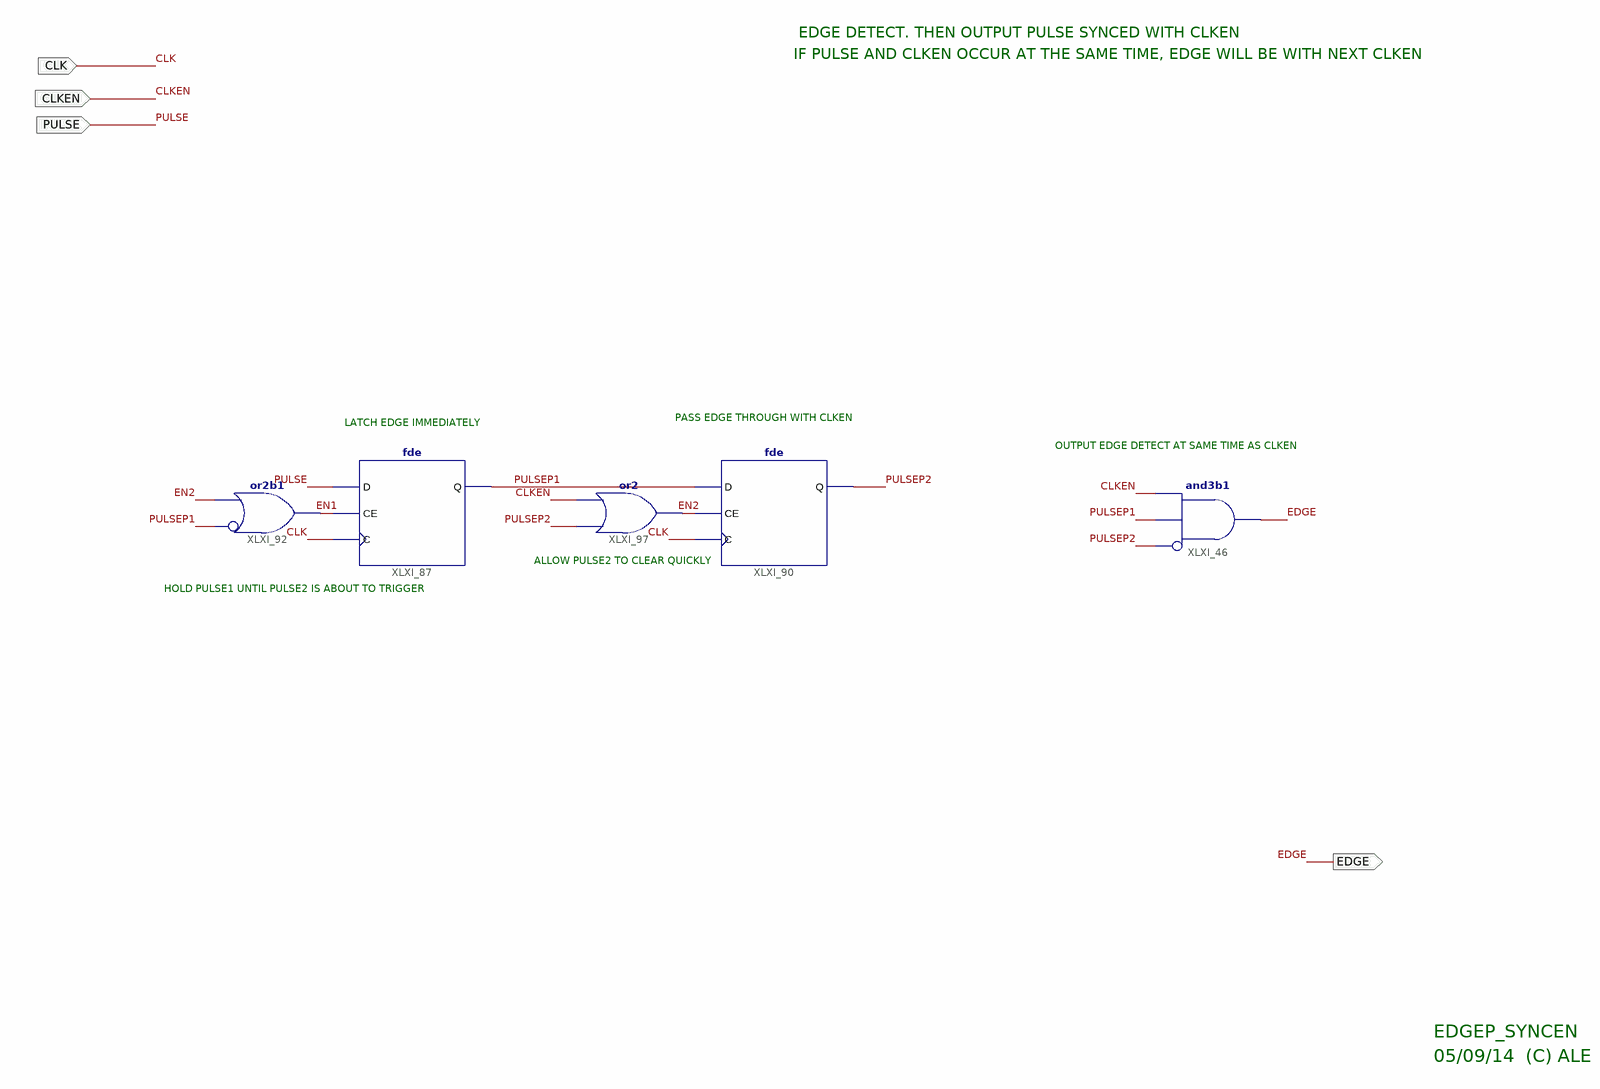
[diagram p0: schematic sheet 1]
// Xilinx ISE schematic EdgeP_SyncEn.sch (spartan3e) as structural Verilog: 5 symbols, 4 ports
module EdgeP_SyncEn (
  input  CLK,
  input  PULSE,
  input  CLKEN,
  output EDGE
);

  wire EN1, EN2, PULSEP1, PULSEP2;

  fde XLXI_87 (.C(CLK), .CE(EN1), .D(PULSE), .Q(PULSEP1));
  or XLXI_92 (EN1, ~PULSEP1, EN2);  // or2b1
  or XLXI_97 (EN2, PULSEP2, CLKEN);
  and XLXI_46 (EDGE, ~PULSEP2, PULSEP1, CLKEN);  // and3b1
  fde XLXI_90 (.C(CLK), .CE(EN2), .D(PULSEP1), .Q(PULSEP2));

  // Notes on the sheet:
  //   EDGE DETECT. THEN OUTPUT PULSE SYNCED WITH CLKEN
  //   IF PULSE AND CLKEN OCCUR AT THE SAME TIME, EDGE WILL BE WITH NEXT CLKEN
  //   PASS EDGE THROUGH WITH CLKEN
  //   LATCH EDGE IMMEDIATELY
  //   OUTPUT EDGE DETECT AT SAME TIME AS CLKEN
  //   ALLOW PULSE2 TO CLEAR QUICKLY
  //   HOLD PULSE1 UNTIL PULSE2 IS ABOUT TO TRIGGER
  //   EDGEP_SYNCEN
  //   05/09/14  (C) ALE
endmodule
